# EAGLE design BUF_BUS_TEE_1 (EAGLE 6.5.0)

## Sheet 1 of 4
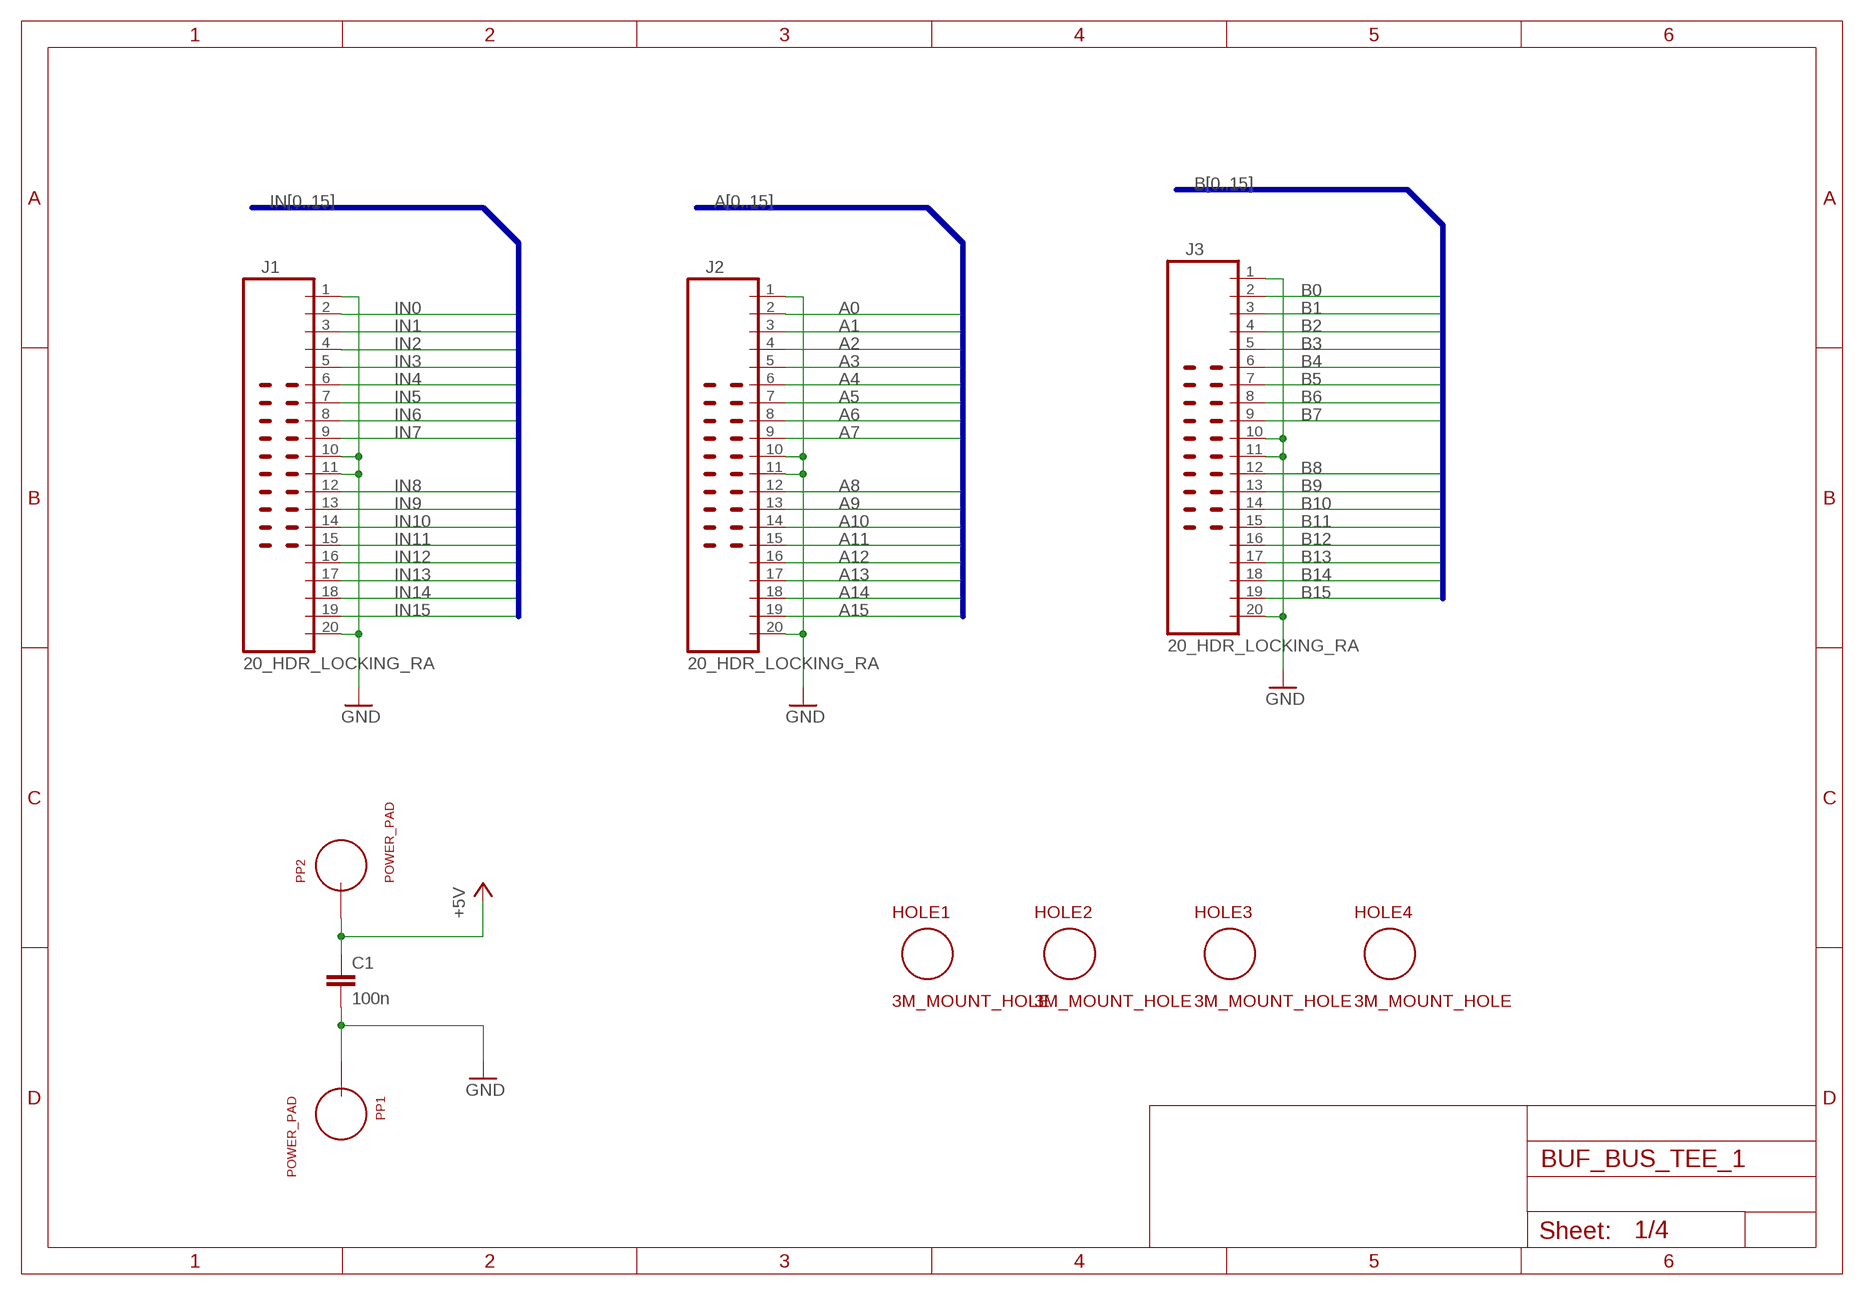
[diagram p0: schematic, sheet 1]

### Parts
C1  100n  C_P2INCH  [CAP_P2INCH]
HOLE1  3M_MOUNT_HOLE  [3M_HOLE]
HOLE2  3M_MOUNT_HOLE  [3M_HOLE]
HOLE3  3M_MOUNT_HOLE  [3M_HOLE]
HOLE4  3M_MOUNT_HOLE  [3M_HOLE]
J1  20_HDR_LOCKING_RA  [20_HDR_LOCKING_RA]
J2  20_HDR_LOCKING_RA  [20_HDR_LOCKING_RA]
J3  20_HDR_LOCKING_RA  [20_HDR_LOCKING_RA]
PP1  POWER_PAD  [POWER_PAD]
PP2  POWER_PAD  [POWER_PAD]

### Nets
+5V: C1.1 PP2.1 ; also sheet 2,3,4
A0: J2.2 ; also sheet 3
A1: J2.3 ; also sheet 3
A2: J2.4 ; also sheet 3
A3: J2.5 ; also sheet 3
A4: J2.6 ; also sheet 3
A5: J2.7 ; also sheet 3
A6: J2.8 ; also sheet 3
A7: J2.9 ; also sheet 3
A8: J2.12 ; also sheet 3
A9: J2.13 ; also sheet 3
A10: J2.14 ; also sheet 3
A11: J2.15 ; also sheet 3
A12: J2.16 ; also sheet 3
A13: J2.17 ; also sheet 3
A14: J2.18 ; also sheet 3
A15: J2.19 ; also sheet 3
B0: J3.2 ; also sheet 4
B1: J3.3 ; also sheet 4
B2: J3.4 ; also sheet 4
B3: J3.5 ; also sheet 4
B4: J3.6 ; also sheet 4
B5: J3.7 ; also sheet 4
B6: J3.8 ; also sheet 4
B7: J3.9 ; also sheet 4
B8: J3.12 ; also sheet 4
B9: J3.13 ; also sheet 4
B10: J3.14 ; also sheet 4
B11: J3.15 ; also sheet 4
B12: J3.16 ; also sheet 4
B13: J3.17 ; also sheet 4
B14: J3.18 ; also sheet 4
B15: J3.19 ; also sheet 4
GND: C1.2 J1.1 J1.10 J1.11 J1.20 J2.1 J2.10 J2.11 J2.20 J3.1 J3.10 J3.11 J3.20 PP1.1 ; also sheet 2,3,4
IN0: J1.2 ; also sheet 2
IN1: J1.3 ; also sheet 2
IN2: J1.4 ; also sheet 2
IN3: J1.5 ; also sheet 2
IN4: J1.6 ; also sheet 2
IN5: J1.7 ; also sheet 2
IN6: J1.8 ; also sheet 2
IN7: J1.9 ; also sheet 2
IN8: J1.12 ; also sheet 2
IN9: J1.13 ; also sheet 2
IN10: J1.14 ; also sheet 2
IN11: J1.15 ; also sheet 2
IN12: J1.16 ; also sheet 2
IN13: J1.17 ; also sheet 2
IN14: J1.18 ; also sheet 2
IN15: J1.19 ; also sheet 2

### Buses
IN[0..15]
A[0..15]
B[0..15]

## Sheet 2 of 4
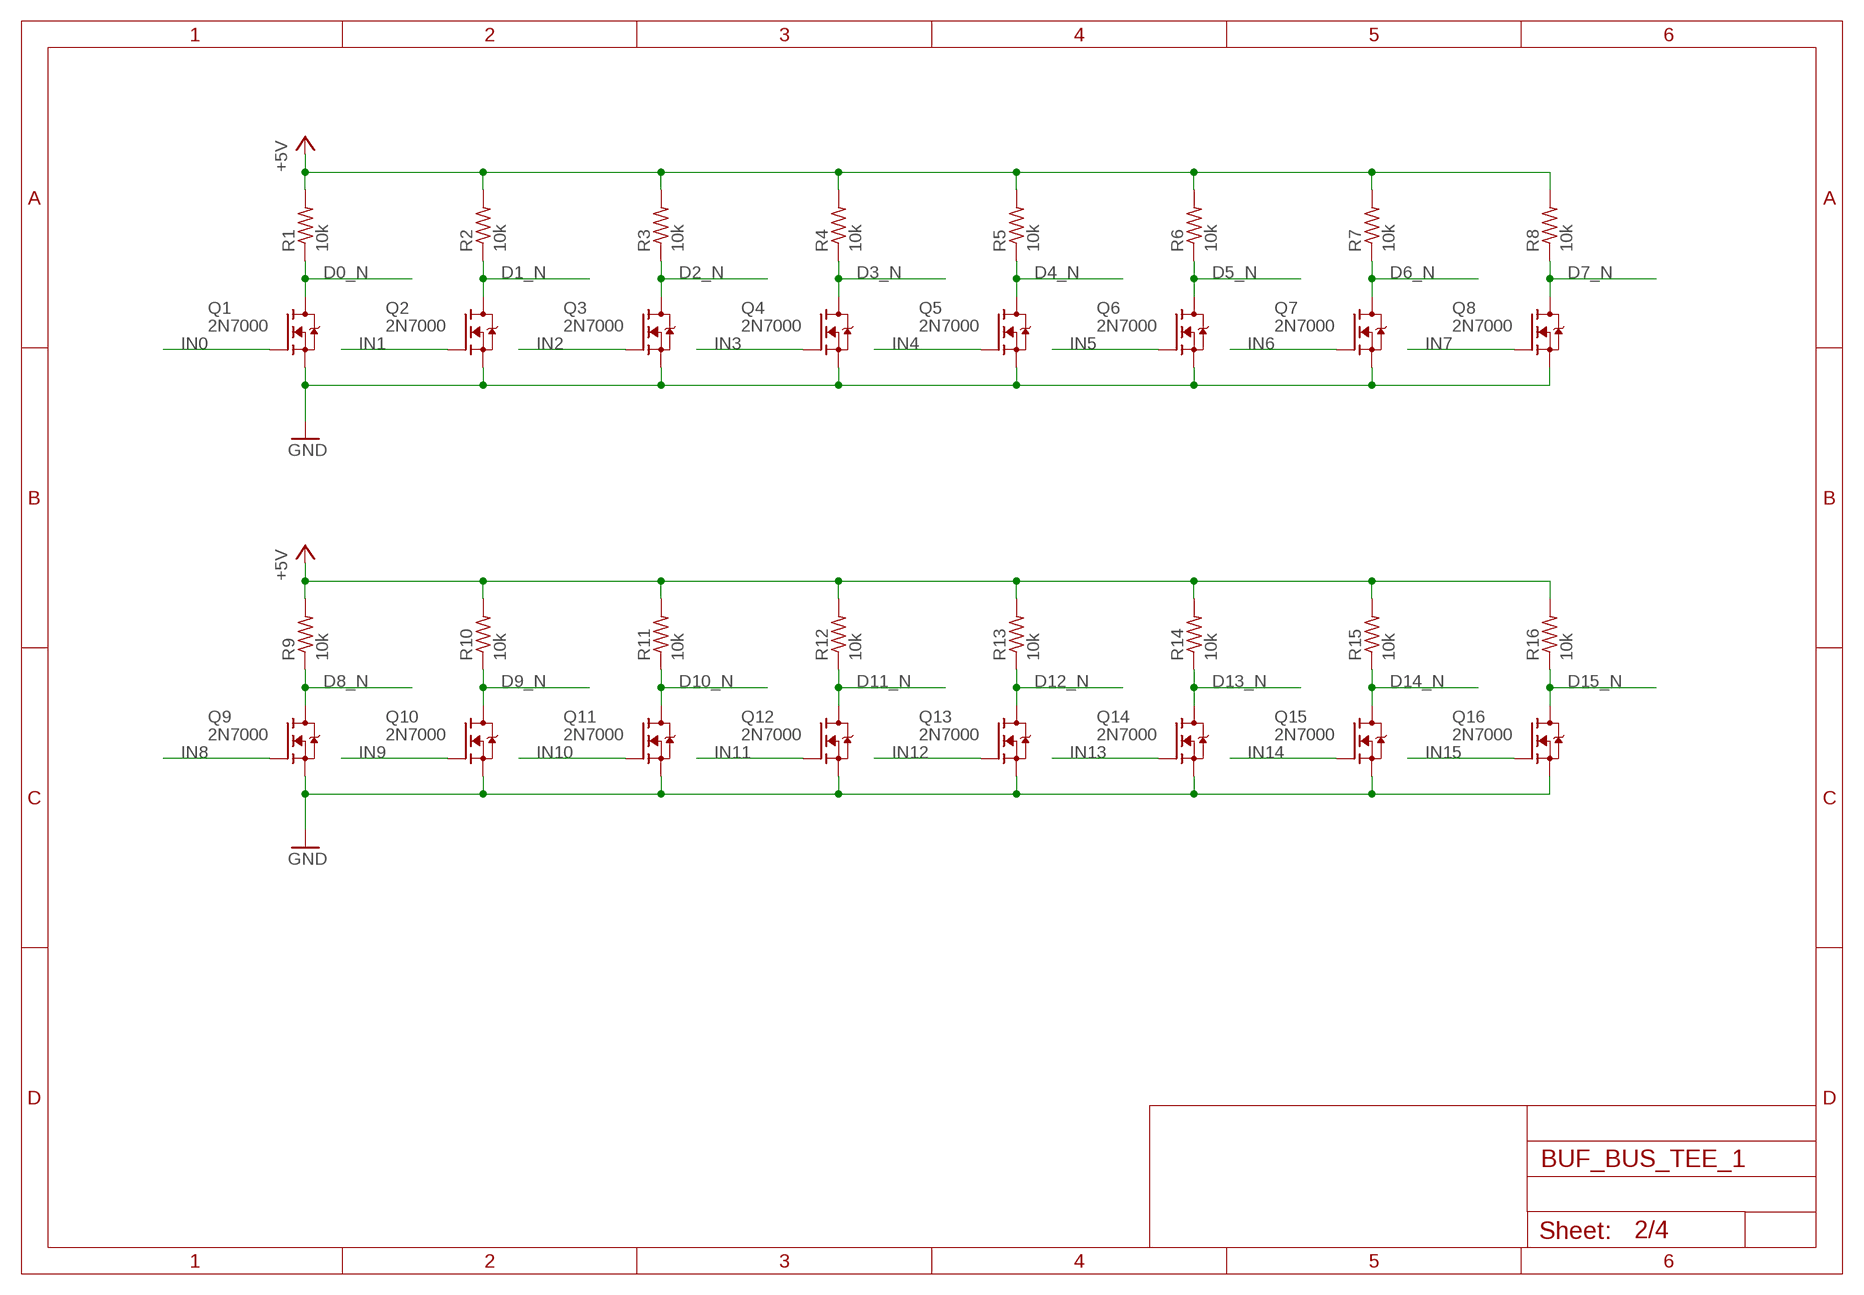
[diagram p1: schematic, sheet 2]

### Parts
Q1  2N7000  [TO92-DGS]
Q2  2N7000  [TO92-DGS]
Q3  2N7000  [TO92-DGS]
Q4  2N7000  [TO92-DGS]
Q5  2N7000  [TO92-DGS]
Q6  2N7000  [TO92-DGS]
Q7  2N7000  [TO92-DGS]
Q8  2N7000  [TO92-DGS]
Q9  2N7000  [TO92-DGS]
Q10  2N7000  [TO92-DGS]
Q11  2N7000  [TO92-DGS]
Q12  2N7000  [TO92-DGS]
Q13  2N7000  [TO92-DGS]
Q14  2N7000  [TO92-DGS]
Q15  2N7000  [TO92-DGS]
Q16  2N7000  [TO92-DGS]
R1  10k  R_P2INCH  [R_P2INCH]
R2  10k  R_P2INCH  [R_P2INCH]
R3  10k  R_P2INCH  [R_P2INCH]
R4  10k  R_P2INCH  [R_P2INCH]
R5  10k  R_P2INCH  [R_P2INCH]
R6  10k  R_P2INCH  [R_P2INCH]
R7  10k  R_P2INCH  [R_P2INCH]
R8  10k  R_P2INCH  [R_P2INCH]
R9  10k  R_P2INCH  [R_P2INCH]
R10  10k  R_P2INCH  [R_P2INCH]
R11  10k  R_P2INCH  [R_P2INCH]
R12  10k  R_P2INCH  [R_P2INCH]
R13  10k  R_P2INCH  [R_P2INCH]
R14  10k  R_P2INCH  [R_P2INCH]
R15  10k  R_P2INCH  [R_P2INCH]
R16  10k  R_P2INCH  [R_P2INCH]

### Nets
+5V: R1.2 R2.2 R3.2 R4.2 R5.2 R6.2 R7.2 R8.2 R9.2 R10.2 R11.2 R12.2 R13.2 R14.2 R15.2 R16.2 ; also sheet 1,3,4
D0_N: Q1.D R1.1 ; also sheet 3,4
D1_N: Q2.D R2.1 ; also sheet 3,4
D2_N: Q3.D R3.1 ; also sheet 3,4
D3_N: Q4.D R4.1 ; also sheet 3,4
D4_N: Q5.D R5.1 ; also sheet 3,4
D5_N: Q6.D R6.1 ; also sheet 3,4
D6_N: Q7.D R7.1 ; also sheet 3,4
D7_N: Q8.D R8.1 ; also sheet 3,4
D8_N: Q9.D R9.1 ; also sheet 3,4
D9_N: Q10.D R10.1 ; also sheet 3,4
D10_N: Q11.D R11.1 ; also sheet 3,4
D11_N: Q12.D R12.1 ; also sheet 3,4
D12_N: Q13.D R13.1 ; also sheet 3,4
D13_N: Q14.D R14.1 ; also sheet 3,4
D14_N: Q15.D R15.1 ; also sheet 3,4
D15_N: Q16.D R16.1 ; also sheet 3,4
GND: Q1.S Q2.S Q3.S Q4.S Q5.S Q6.S Q7.S Q8.S Q9.S Q10.S Q11.S Q12.S Q13.S Q14.S Q15.S Q16.S ; also sheet 1,3,4
IN0: Q1.G ; also sheet 1
IN1: Q2.G ; also sheet 1
IN2: Q3.G ; also sheet 1
IN3: Q4.G ; also sheet 1
IN4: Q5.G ; also sheet 1
IN5: Q6.G ; also sheet 1
IN6: Q7.G ; also sheet 1
IN7: Q8.G ; also sheet 1
IN8: Q9.G ; also sheet 1
IN9: Q10.G ; also sheet 1
IN10: Q11.G ; also sheet 1
IN11: Q12.G ; also sheet 1
IN12: Q13.G ; also sheet 1
IN13: Q14.G ; also sheet 1
IN14: Q15.G ; also sheet 1
IN15: Q16.G ; also sheet 1

## Sheet 3 of 4
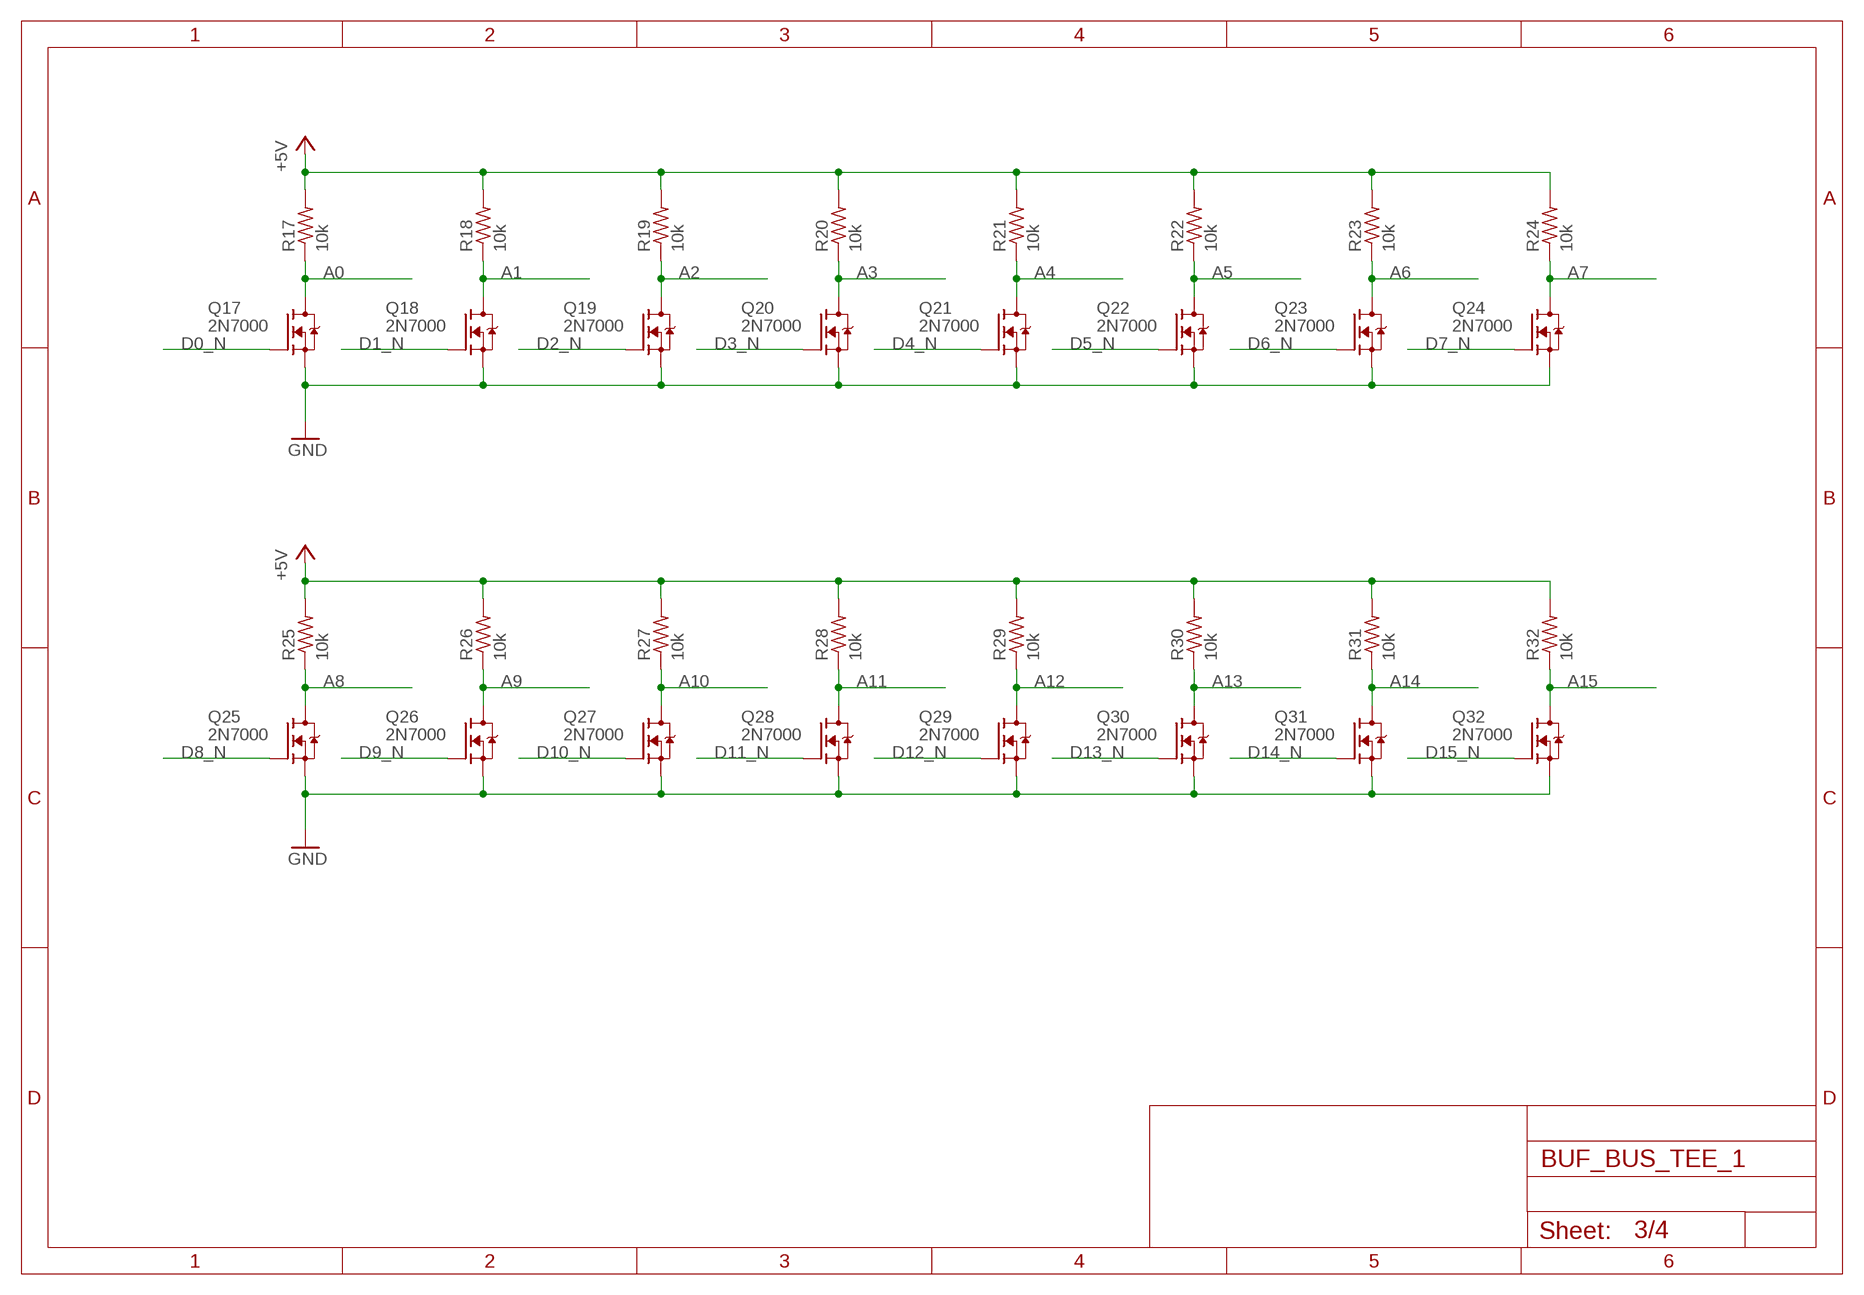
[diagram p2: schematic, sheet 3]

### Parts
Q17  2N7000  [TO92-DGS]
Q18  2N7000  [TO92-DGS]
Q19  2N7000  [TO92-DGS]
Q20  2N7000  [TO92-DGS]
Q21  2N7000  [TO92-DGS]
Q22  2N7000  [TO92-DGS]
Q23  2N7000  [TO92-DGS]
Q24  2N7000  [TO92-DGS]
Q25  2N7000  [TO92-DGS]
Q26  2N7000  [TO92-DGS]
Q27  2N7000  [TO92-DGS]
Q28  2N7000  [TO92-DGS]
Q29  2N7000  [TO92-DGS]
Q30  2N7000  [TO92-DGS]
Q31  2N7000  [TO92-DGS]
Q32  2N7000  [TO92-DGS]
R17  10k  R_P2INCH  [R_P2INCH]
R18  10k  R_P2INCH  [R_P2INCH]
R19  10k  R_P2INCH  [R_P2INCH]
R20  10k  R_P2INCH  [R_P2INCH]
R21  10k  R_P2INCH  [R_P2INCH]
R22  10k  R_P2INCH  [R_P2INCH]
R23  10k  R_P2INCH  [R_P2INCH]
R24  10k  R_P2INCH  [R_P2INCH]
R25  10k  R_P2INCH  [R_P2INCH]
R26  10k  R_P2INCH  [R_P2INCH]
R27  10k  R_P2INCH  [R_P2INCH]
R28  10k  R_P2INCH  [R_P2INCH]
R29  10k  R_P2INCH  [R_P2INCH]
R30  10k  R_P2INCH  [R_P2INCH]
R31  10k  R_P2INCH  [R_P2INCH]
R32  10k  R_P2INCH  [R_P2INCH]

### Nets
+5V: R17.2 R18.2 R19.2 R20.2 R21.2 R22.2 R23.2 R24.2 R25.2 R26.2 R27.2 R28.2 R29.2 R30.2 R31.2 R32.2 ; also sheet 1,2,4
A0: Q17.D R17.1 ; also sheet 1
A1: Q18.D R18.1 ; also sheet 1
A2: Q19.D R19.1 ; also sheet 1
A3: Q20.D R20.1 ; also sheet 1
A4: Q21.D R21.1 ; also sheet 1
A5: Q22.D R22.1 ; also sheet 1
A6: Q23.D R23.1 ; also sheet 1
A7: Q24.D R24.1 ; also sheet 1
A8: Q25.D R25.1 ; also sheet 1
A9: Q26.D R26.1 ; also sheet 1
A10: Q27.D R27.1 ; also sheet 1
A11: Q28.D R28.1 ; also sheet 1
A12: Q29.D R29.1 ; also sheet 1
A13: Q30.D R30.1 ; also sheet 1
A14: Q31.D R31.1 ; also sheet 1
A15: Q32.D R32.1 ; also sheet 1
D0_N: Q17.G ; also sheet 2,4
D1_N: Q18.G ; also sheet 2,4
D2_N: Q19.G ; also sheet 2,4
D3_N: Q20.G ; also sheet 2,4
D4_N: Q21.G ; also sheet 2,4
D5_N: Q22.G ; also sheet 2,4
D6_N: Q23.G ; also sheet 2,4
D7_N: Q24.G ; also sheet 2,4
D8_N: Q25.G ; also sheet 2,4
D9_N: Q26.G ; also sheet 2,4
D10_N: Q27.G ; also sheet 2,4
D11_N: Q28.G ; also sheet 2,4
D12_N: Q29.G ; also sheet 2,4
D13_N: Q30.G ; also sheet 2,4
D14_N: Q31.G ; also sheet 2,4
D15_N: Q32.G ; also sheet 2,4
GND: Q17.S Q18.S Q19.S Q20.S Q21.S Q22.S Q23.S Q24.S Q25.S Q26.S Q27.S Q28.S Q29.S Q30.S Q31.S Q32.S ; also sheet 1,2,4

## Sheet 4 of 4
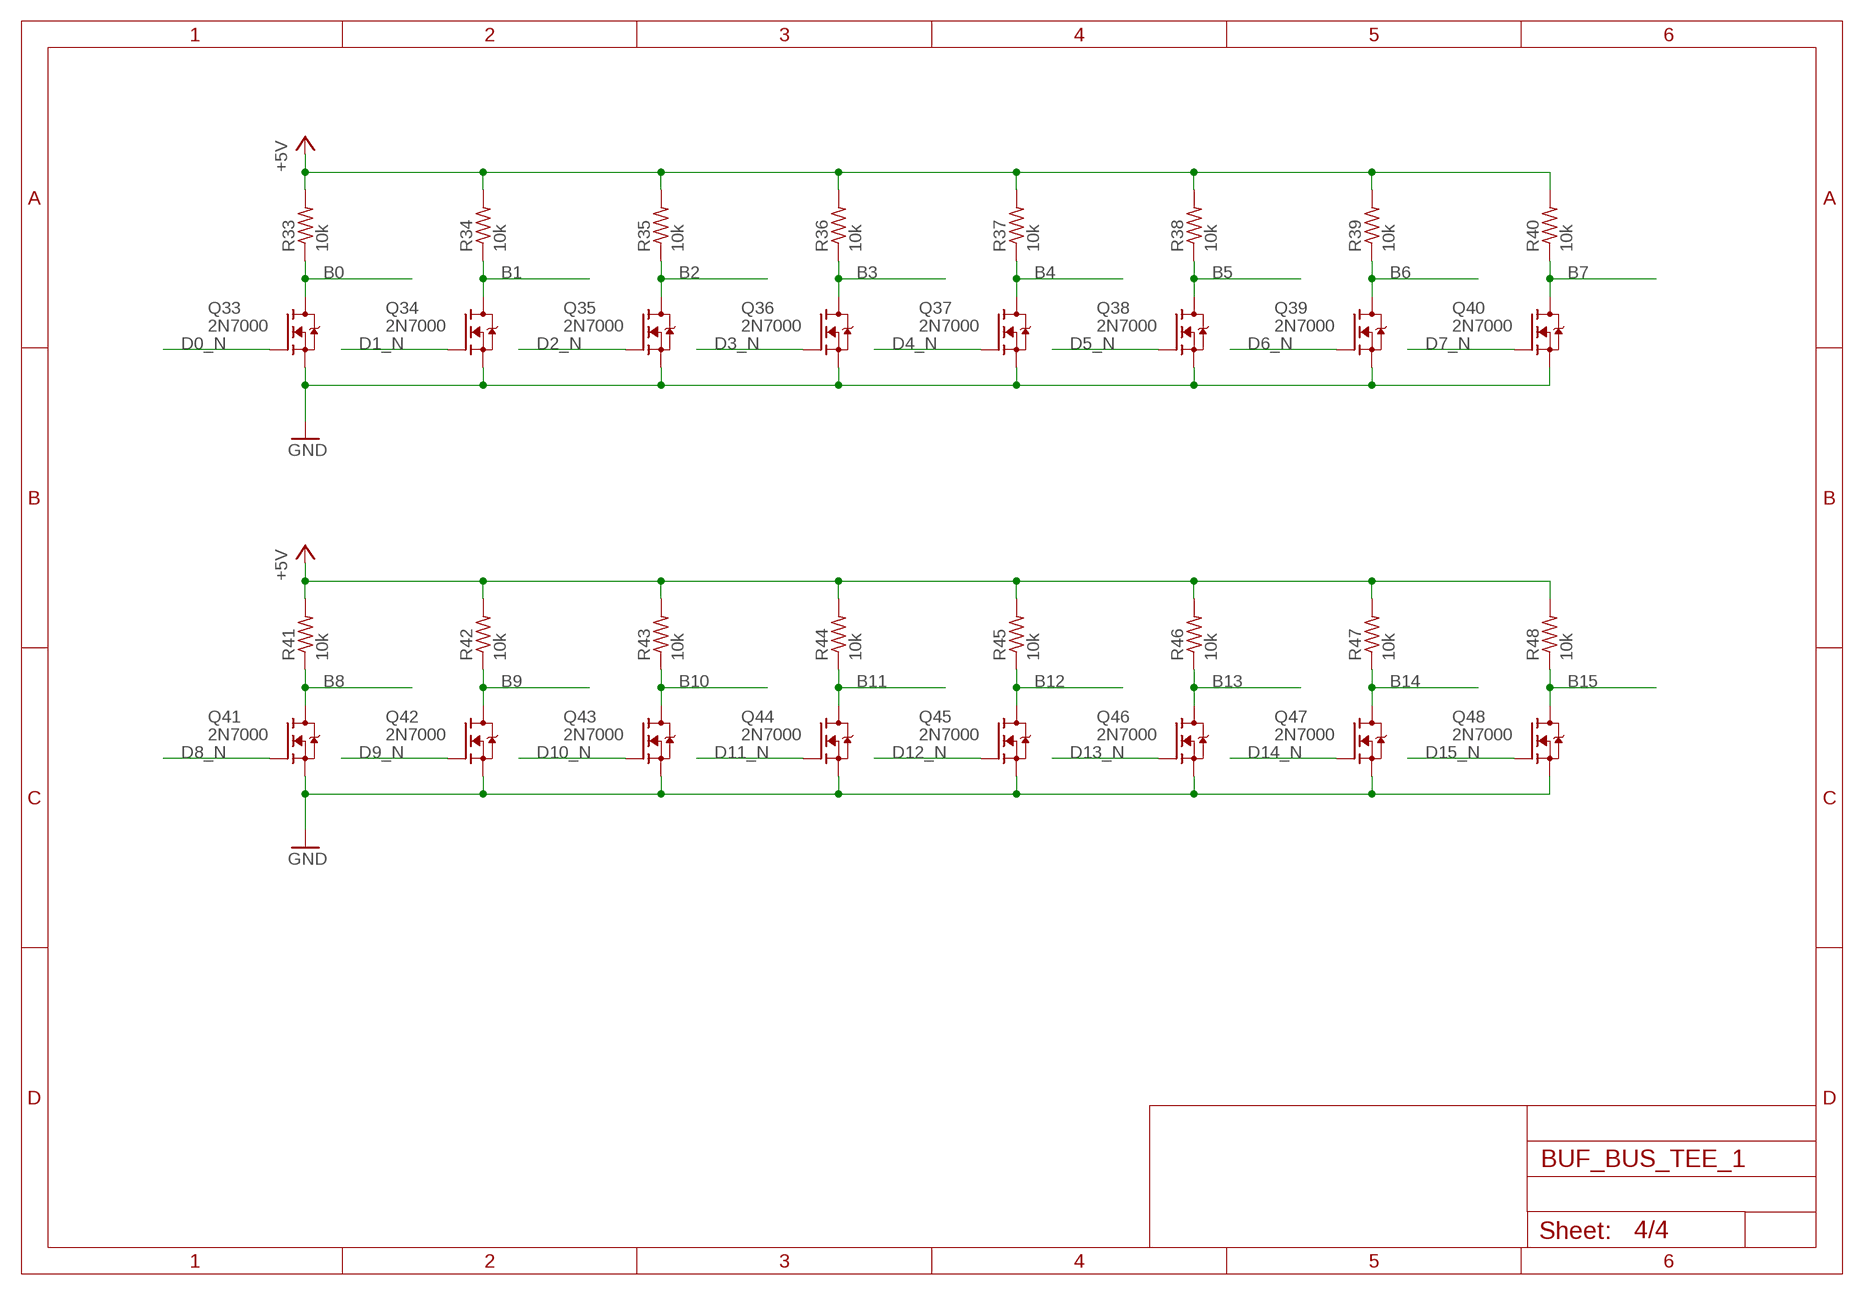
[diagram p3: schematic, sheet 4]

### Parts
Q33  2N7000  [TO92-DGS]
Q34  2N7000  [TO92-DGS]
Q35  2N7000  [TO92-DGS]
Q36  2N7000  [TO92-DGS]
Q37  2N7000  [TO92-DGS]
Q38  2N7000  [TO92-DGS]
Q39  2N7000  [TO92-DGS]
Q40  2N7000  [TO92-DGS]
Q41  2N7000  [TO92-DGS]
Q42  2N7000  [TO92-DGS]
Q43  2N7000  [TO92-DGS]
Q44  2N7000  [TO92-DGS]
Q45  2N7000  [TO92-DGS]
Q46  2N7000  [TO92-DGS]
Q47  2N7000  [TO92-DGS]
Q48  2N7000  [TO92-DGS]
R33  10k  R_P2INCH  [R_P2INCH]
R34  10k  R_P2INCH  [R_P2INCH]
R35  10k  R_P2INCH  [R_P2INCH]
R36  10k  R_P2INCH  [R_P2INCH]
R37  10k  R_P2INCH  [R_P2INCH]
R38  10k  R_P2INCH  [R_P2INCH]
R39  10k  R_P2INCH  [R_P2INCH]
R40  10k  R_P2INCH  [R_P2INCH]
R41  10k  R_P2INCH  [R_P2INCH]
R42  10k  R_P2INCH  [R_P2INCH]
R43  10k  R_P2INCH  [R_P2INCH]
R44  10k  R_P2INCH  [R_P2INCH]
R45  10k  R_P2INCH  [R_P2INCH]
R46  10k  R_P2INCH  [R_P2INCH]
R47  10k  R_P2INCH  [R_P2INCH]
R48  10k  R_P2INCH  [R_P2INCH]

### Nets
+5V: R33.2 R34.2 R35.2 R36.2 R37.2 R38.2 R39.2 R40.2 R41.2 R42.2 R43.2 R44.2 R45.2 R46.2 R47.2 R48.2 ; also sheet 1,2,3
B0: Q33.D R33.1 ; also sheet 1
B1: Q34.D R34.1 ; also sheet 1
B2: Q35.D R35.1 ; also sheet 1
B3: Q36.D R36.1 ; also sheet 1
B4: Q37.D R37.1 ; also sheet 1
B5: Q38.D R38.1 ; also sheet 1
B6: Q39.D R39.1 ; also sheet 1
B7: Q40.D R40.1 ; also sheet 1
B8: Q41.D R41.1 ; also sheet 1
B9: Q42.D R42.1 ; also sheet 1
B10: Q43.D R43.1 ; also sheet 1
B11: Q44.D R44.1 ; also sheet 1
B12: Q45.D R45.1 ; also sheet 1
B13: Q46.D R46.1 ; also sheet 1
B14: Q47.D R47.1 ; also sheet 1
B15: Q48.D R48.1 ; also sheet 1
D0_N: Q33.G ; also sheet 2,3
D1_N: Q34.G ; also sheet 2,3
D2_N: Q35.G ; also sheet 2,3
D3_N: Q36.G ; also sheet 2,3
D4_N: Q37.G ; also sheet 2,3
D5_N: Q38.G ; also sheet 2,3
D6_N: Q39.G ; also sheet 2,3
D7_N: Q40.G ; also sheet 2,3
D8_N: Q41.G ; also sheet 2,3
D9_N: Q42.G ; also sheet 2,3
D10_N: Q43.G ; also sheet 2,3
D11_N: Q44.G ; also sheet 2,3
D12_N: Q45.G ; also sheet 2,3
D13_N: Q46.G ; also sheet 2,3
D14_N: Q47.G ; also sheet 2,3
D15_N: Q48.G ; also sheet 2,3
GND: Q33.S Q34.S Q35.S Q36.S Q37.S Q38.S Q39.S Q40.S Q41.S Q42.S Q43.S Q44.S Q45.S Q46.S Q47.S Q48.S ; also sheet 1,2,3

## Library data of the parts
C1 = MyLib:C_P2INCH
HOLE1-HOLE4 = MyLib:3M_MOUNT_HOLE
J1-J3 = MyLib:20_HDR_LOCKING_RA
PP1 PP2 = MyLib:POWER_PAD
Q1-Q48 = MyLib:2N7000
R1-R48 = MyLib:R_P2INCH

## Board
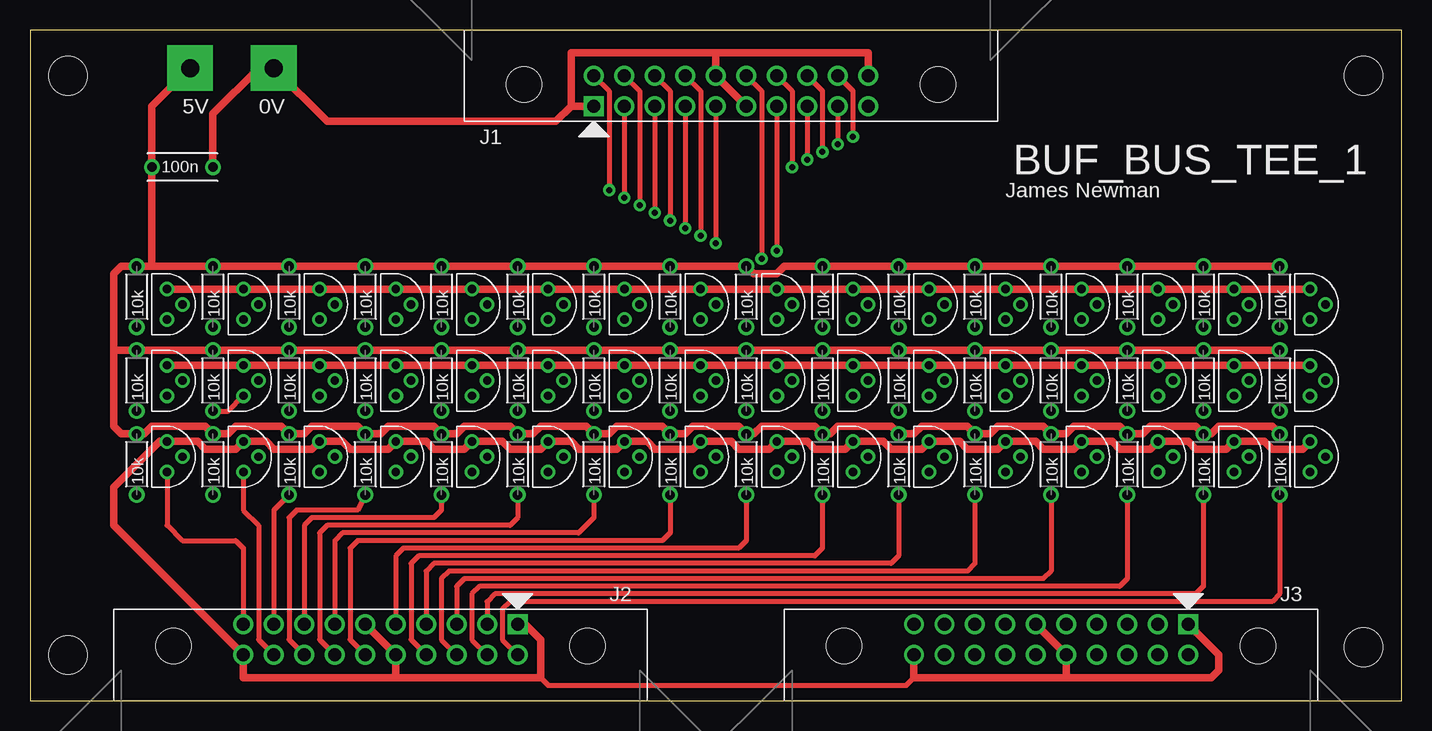
[diagram p4: board, top side]
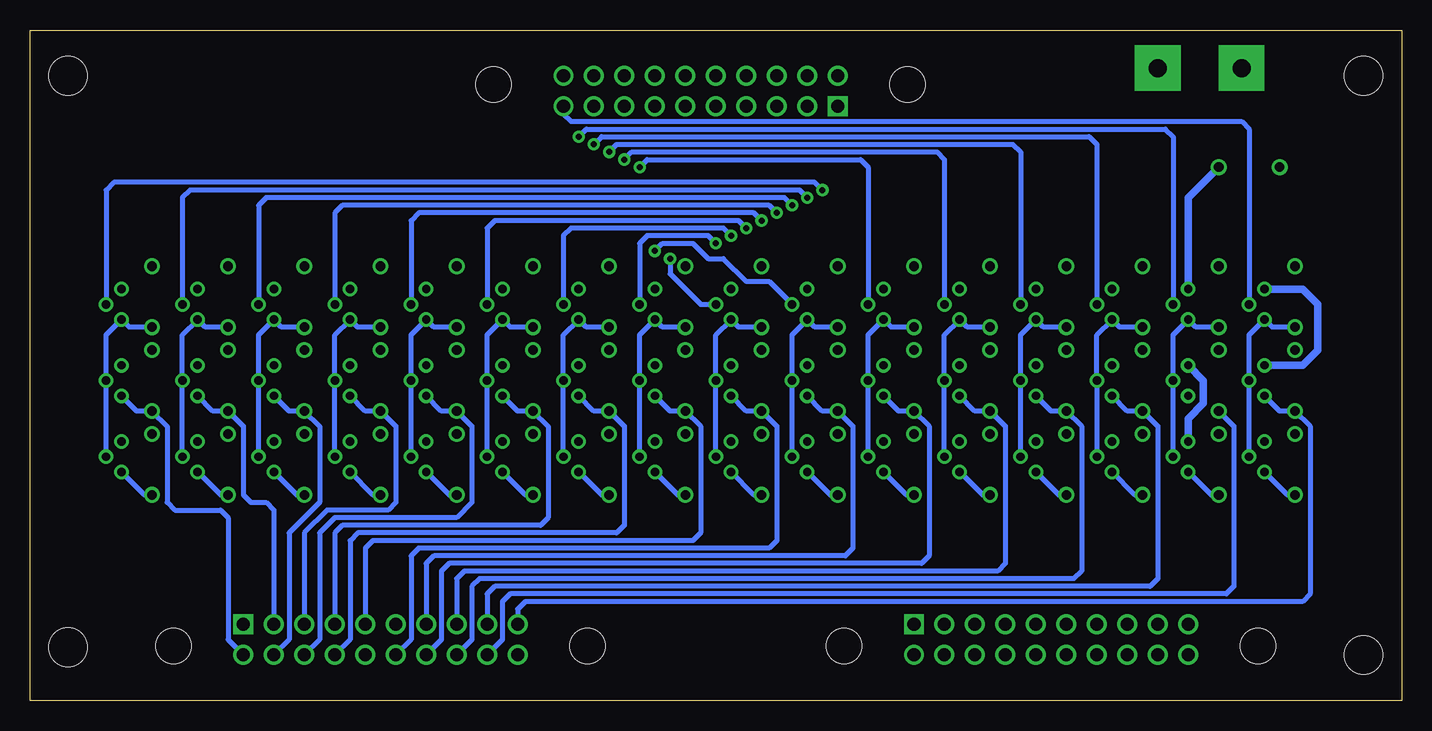
[diagram p5: board, bottom side, seen from below]

Size 114.3 x 55.88 mm. Coordinates in mm from the lower left corner, seen from the top.
Outline: 0,0 114.3,0 114.3,55.88 0,55.88 0,0
Copper layers (1*16): Top 0.035mm / dielectric 1.5mm / Bottom 0.035mm
Design rules "processor_rules_2layer": minimum track width 8mil, minimum drill 14mil, track to track 8mil, track to pad 8mil, pad to pad 8mil, via to via 8mil, smd to smd 8mil, copper to edge 40mil, drill to drill 8mil, minimum pad ring 10mil, minimum via ring 8mil, stop-mask expansion 4mil, vias tented up to drill 0.7mm, thermal gap 10mil

### Footprints (pad centres in the part's own frame; a part is rotated, then mirrored left to right if it is on the bottom)
CAP_P2INCH = drill 0.8: 1 -2.54,0; 2 2.54,0
3M_HOLE = hole 3.2: 0,0
20_HDR_LOCKING_RA = drill 1.1 square: 1 -11.43,-1.27 | drill 1.1: 2 -11.43,1.27; 3 -8.89,-1.27; 4 -8.89,1.27; 5 -6.35,-1.27; 6 -6.35,1.27; 7 -3.81,-1.27; 8 -3.81,1.27; 9 -1.27,-1.27; 10 -1.27,1.27; 11 1.27,-1.27; 12 1.27,1.27; 13 3.81,-1.27; 14 3.81,1.27; 15 6.35,-1.27; 16 6.35,1.27; 17 8.89,-1.27; 18 8.89,1.27; 19 11.43,-1.27; 20 11.43,1.27 | hole 2.946: -17.247,0.533; 17.247,0.533
POWER_PAD = drill 1.5 pad 3.81 square: 1 0,0
TO92-DGS = drill 0.7: D 0,1.27; G -1.27,0; S 0,-1.27
R_P2INCH = drill 0.8: 1 -2.54,0; 2 2.54,0

### Placement (x,y rotation side)
C1  12.7,44.45 0 top
HOLE1  3.17,3.81 0 top
HOLE2  111.12,4.45 0 top
HOLE3  111.12,52.07 0 top
HOLE4  3.17,52.07 0 top
J1  58.42,50.8 0 top
J2  29.21,5.08 180 top
J3  85.09,5.08 180 top
PP1  20.32,52.7 0 top
PP2  13.34,52.7 0 top
Q1  106.68,33.02 180 top
Q2  100.33,33.02 180 top
Q3  93.98,33.02 180 top
Q4  87.63,33.02 180 top
Q5  81.28,33.02 180 top
Q6  74.93,33.02 180 top
Q7  68.58,33.02 180 top
Q8  62.23,33.02 180 top
Q9  55.88,33.02 180 top
Q10  49.53,33.02 180 top
Q11  43.18,33.02 180 top
Q12  36.83,33.02 180 top
Q13  30.48,33.02 180 top
Q14  24.13,33.02 180 top
Q15  17.78,33.02 180 top
Q16  11.43,33.02 180 top
Q17  106.68,20.32 180 top
Q18  100.33,20.32 180 top
Q19  93.98,20.32 180 top
Q20  87.63,20.32 180 top
Q21  81.28,20.32 180 top
Q22  74.93,20.32 180 top
Q23  68.58,20.32 180 top
Q24  62.23,20.32 180 top
Q25  55.88,20.32 180 top
Q26  49.53,20.32 180 top
Q27  43.18,20.32 180 top
Q28  36.83,20.32 180 top
Q29  30.48,20.32 180 top
Q30  24.13,20.32 180 top
Q31  17.78,20.32 180 top
Q32  11.43,20.32 180 top
Q33  106.68,26.67 180 top
Q34  100.33,26.67 180 top
Q35  93.98,26.67 180 top
Q36  87.63,26.67 180 top
Q37  81.28,26.67 180 top
Q38  74.93,26.67 180 top
Q39  68.58,26.67 180 top
Q40  62.23,26.67 180 top
Q41  55.88,26.67 180 top
Q42  49.53,26.67 180 top
Q43  43.18,26.67 180 top
Q44  36.83,26.67 180 top
Q45  30.48,26.67 180 top
Q46  24.13,26.67 180 top
Q47  17.78,26.67 180 top
Q48  11.43,26.67 180 top
R1  104.14,33.66 90 top
R2  97.79,33.66 90 top
R3  91.44,33.66 90 top
R4  85.09,33.66 90 top
R5  78.74,33.66 90 top
R6  72.39,33.66 90 top
R7  66.04,33.66 90 top
R8  59.69,33.66 90 top
R9  53.34,33.66 90 top
R10  46.99,33.66 90 top
R11  40.64,33.66 90 top
R12  34.29,33.66 90 top
R13  27.94,33.66 90 top
R14  21.59,33.66 90 top
R15  15.24,33.66 90 top
R16  8.89,33.66 90 top
R17  104.14,19.68 90 top
R18  97.79,19.68 90 top
R19  91.44,19.68 90 top
R20  85.09,19.68 90 top
R21  78.74,19.68 90 top
R22  72.39,19.68 90 top
R23  66.04,19.68 90 top
R24  59.69,19.68 90 top
R25  53.34,19.68 90 top
R26  46.99,19.68 90 top
R27  40.64,19.68 90 top
R28  34.29,19.68 90 top
R29  27.94,19.68 90 top
R30  21.59,19.68 90 top
R31  15.24,19.68 90 top
R32  8.89,19.68 90 top
R33  104.14,26.67 90 top
R34  97.79,26.67 90 top
R35  91.44,26.67 90 top
R36  85.09,26.67 90 top
R37  78.74,26.67 90 top
R38  72.39,26.67 90 top
R39  66.04,26.67 90 top
R40  59.69,26.67 90 top
R41  53.34,26.67 90 top
R42  46.99,26.67 90 top
R43  40.64,26.67 90 top
R44  34.29,26.67 90 top
R45  27.94,26.67 90 top
R46  21.59,26.67 90 top
R47  15.24,26.67 90 top
R48  8.89,26.67 90 top

### Tracks (layer width: path | path; a pad name or v marks a point on that pad's centre or on a via)
+5V
  Top 0.61: 10.16,36.2 R16.2 7.62,36.2 6.99,35.56 6.99,29.21 | 10.16,36.2 R15.2 R14.2 R13.2 R12.2 R11.2 R10.2 R9.2 R8.2 60.33,35.56 62.23,35.56 62.87,36.2 R7.2 R6.2 R5.2 R4.2 R3.2 R2.2 R1.2 | R33.2 R34.2 R35.2 R36.2 R37.2 R38.2 R39.2 R40.2 R41.2 R42.2 R43.2 R44.2 R45.2 R46.2 R47.2 R48.2 6.99,29.21 | R17.2 103.5,22.86 99.06,22.86 98.42,22.23 R18.2 97.16,22.86 93.34,22.86 92.71,22.23 R19.2 90.81,22.86 87,22.86 86.36,22.23 R20.2 84.45,22.86 80.64,22.86 80.01,22.23 R21.2 78.11,22.86 74.3,22.86 73.66,22.23 R22.2 71.75,22.86 67.31,22.86 66.67,22.23 R23.2 65.41,22.86 60.96,22.86 60.33,22.23 R24.2 59.05,22.86 55.24,22.86 54.61,22.23 R25.2 52.7,22.86 48.9,22.86 48.26,22.23 R26.2 46.35,22.86 42.55,22.86 41.91,22.23 R27.2 40.01,22.86 36.2,22.86 35.56,22.23 R28.2 33.66,22.86 29.84,22.86 29.21,22.23 R29.2 27.3,22.86 23.5,22.86 22.86,22.23 R30.2 20.95,22.86 17.14,22.86 16.51,22.23 R31.2 14.61,22.86 10.16,22.86 9.53,22.23 R32.2 7.62,22.23 6.99,22.86 6.99,29.21 | 10.16,36.2 C1.1 10.16,49.53 PP2.1
A0
  Top 0.406: R17.1 104.14,8.89 103.5,8.26 40.01,8.26 39.37,7.62 39.37,5.08 J2.2
  Bottom 0.406: R17.1 104.78,17.14 Q17.D
A1
  Top 0.406: R18.1 97.79,9.53 97.16,8.89 38.73,8.89 38.1,8.26 J2.3
  Bottom 0.406: R18.1 98.42,17.14 Q18.D
A2
  Top 0.406: R19.1 91.44,10.16 90.81,9.53 37.47,9.53 36.83,8.89 36.83,5.08 J2.4
  Bottom 0.406: R19.1 92.08,17.14 Q19.D
A3
  Top 0.406: R20.1 85.09,10.79 84.45,10.16 36.2,10.16 35.56,9.53 J2.5
  Bottom 0.406: R20.1 85.72,17.14 Q20.D
A4
  Top 0.406: R21.1 78.74,11.43 78.11,10.79 34.92,10.79 34.29,10.16 34.29,5.08 J2.6
  Bottom 0.406: R21.1 79.38,17.14 Q21.D
A5
  Top 0.406: R22.1 72.39,12.06 71.75,11.43 33.66,11.43 33.02,10.79 J2.7
  Bottom 0.406: R22.1 73.03,17.14 Q22.D
A6
  Top 0.406: R23.1 66.04,12.7 65.41,12.06 32.38,12.06 31.75,11.43 31.75,5.08 J2.8
  Bottom 0.406: R23.1 66.67,17.14 Q23.D
A7
  Top 0.406: R24.1 59.69,13.34 59.05,12.7 31.11,12.7 30.48,12.06 J2.9
  Bottom 0.406: R24.1 60.33,17.14 Q24.D
A8
  Top 0.406: R25.1 53.34,13.97 52.7,13.34 27.3,13.34 26.67,12.7 26.67,5.08 J2.12
  Bottom 0.406: R25.1 53.98,17.14 Q25.D
A9
  Top 0.406: R26.1 46.99,15.24 45.72,13.97 26.04,13.97 25.4,13.34 J2.13
  Bottom 0.406: R26.1 47.62,17.14 Q26.D
A10
  Top 0.406: R27.1 40.64,15.24 40.01,14.61 24.77,14.61 24.13,13.97 24.13,5.08 J2.14
  Bottom 0.406: R27.1 41.27,17.14 Q27.D
A11
  Top 0.406: R28.1 34.29,15.88 33.66,15.24 23.5,15.24 22.86,14.61 J2.15
  Bottom 0.406: R28.1 34.92,17.14 Q28.D
A12
  Top 0.406: R29.1 27.3,15.88 22.23,15.88 21.59,15.24 21.59,5.08 J2.16
  Bottom 0.406: R29.1 28.57,17.14 Q29.D
A13
  Top 0.406: R30.1 20.32,15.88 J2.17
  Bottom 0.406: R30.1 22.23,17.14 Q30.D
A14
  Top 0.406: Q31.D 17.78,15.88 19.05,14.61 19.05,5.08 J2.18
  Bottom 0.406: R31.1 15.88,17.14 Q31.D
A15
  Top 0.406: Q32.D 11.43,14.61 12.7,13.34 17.14,13.34 17.78,12.7 J2.19
  Bottom 0.406: R32.1 9.53,17.14 Q32.D
B0
  Bottom 0.406: J3.2 97.79,5.08 97.79,15.24 98.42,15.88 102.23,15.88 102.87,16.51 102.87,22.86 R33.1 105.41,24.13 Q33.D
B1
  Bottom 0.406: J3.3 93.98,15.88 94.61,16.51 95.89,16.51 96.52,17.14 96.52,22.86 R34.1 99.06,24.13 Q34.D
B2
  Bottom 0.406: J3.4 92.71,5.08 92.71,13.97 90.17,16.51 90.17,22.86 R35.1 92.71,24.13 Q35.D
B3
  Bottom 0.406: J3.5 91.44,13.97 89.53,15.88 84.45,15.88 83.82,16.51 83.82,22.86 R36.1 86.36,24.13 Q36.D
B4
  Bottom 0.406: J3.6 90.17,5.08 90.17,13.97 88.9,15.24 78.74,15.24 77.47,16.51 77.47,22.86 R37.1 80.01,24.13 Q37.D
B5
  Bottom 0.406: J3.7 88.9,13.97 88.27,14.61 71.75,14.61 71.12,15.24 71.12,22.86 R38.1 73.66,24.13 Q38.D
B6
  Bottom 0.406: J3.8 87.63,5.08 87.63,13.34 87,13.97 65.41,13.97 64.77,14.61 64.77,22.86 R39.1 67.31,24.13 Q39.D
B7
  Bottom 0.406: J3.9 86.36,12.7 85.72,13.34 59.05,13.34 58.42,13.97 58.42,22.86 R40.1 60.96,24.13 Q40.D
B8
  Bottom 0.406: J3.12 82.55,5.08 82.55,12.06 81.92,12.7 52.7,12.7 52.07,13.34 52.07,22.86 R41.1 54.61,24.13 Q41.D
B9
  Bottom 0.406: J3.13 81.28,11.43 80.64,12.06 46.35,12.06 45.72,12.7 45.72,22.86 R42.1 48.26,24.13 Q42.D
B10
  Bottom 0.406: J3.14 80.01,5.08 80.01,10.79 79.38,11.43 40.01,11.43 39.37,12.06 39.37,22.86 R43.1 41.91,24.13 Q43.D
B11
  Bottom 0.406: J3.15 78.74,10.16 78.11,10.79 33.66,10.79 33.02,11.43 33.02,22.86 R44.1 35.56,24.13 Q44.D
B12
  Bottom 0.406: J3.16 77.47,5.08 77.47,9.53 76.83,10.16 27.3,10.16 26.67,10.79 26.67,22.86 R45.1 29.21,24.13 Q45.D
B13
  Bottom 0.406: J3.17 76.2,8.89 75.56,9.53 20.95,9.53 20.32,10.16 20.32,22.86 R46.1 22.86,24.13 Q46.D
B14
  Top 0.406: R47.1 16.51,24.13 Q47.D
  Bottom 0.406: J3.18 74.93,5.08 74.93,8.26 74.3,8.89 14.61,8.89 13.97,9.53 13.97,22.86 R47.1
B15
  Bottom 0.406: J3.19 73.66,7.62 73.03,8.26 8.26,8.26 7.62,8.89 7.62,22.86 R48.1 10.16,24.13 Q48.D
D0_N
  Bottom 0.406: R1.1 106.05,31.11 Q1.D 107.95,30.48 Q33.G Q17.G
D1_N
  Bottom 0.406: R2.1 99.69,31.11 Q2.D 101.6,30.48 Q34.G Q18.G
D2_N
  Bottom 0.406: R3.1 93.34,31.11 Q3.D 95.25,30.48 Q35.G Q19.G
D3_N
  Bottom 0.406: R4.1 87,31.11 Q4.D 88.9,30.48 Q36.G Q20.G
D4_N
  Bottom 0.406: R5.1 80.64,31.11 Q5.D 82.55,30.48 Q37.G Q21.G
D5_N
  Bottom 0.406: R6.1 74.3,31.11 Q6.D 76.2,30.48 Q38.G Q22.G
D6_N
  Bottom 0.406: R7.1 67.94,31.11 Q7.D 69.85,30.48 Q39.G Q23.G
D7_N
  Bottom 0.406: R8.1 61.59,31.11 Q8.D 63.5,30.48 Q40.G Q24.G
D8_N
  Bottom 0.406: R9.1 55.24,31.11 Q9.D 57.15,30.48 Q41.G Q25.G
D9_N
  Bottom 0.406: R10.1 48.9,31.11 Q10.D 50.8,30.48 Q42.G Q26.G
D10_N
  Bottom 0.406: R11.1 42.55,31.11 Q11.D 44.45,30.48 Q43.G Q27.G
D11_N
  Bottom 0.406: R12.1 36.2,31.11 Q12.D 38.1,30.48 Q44.G Q28.G
D12_N
  Bottom 0.406: R13.1 29.84,31.11 Q13.D 31.75,30.48 Q45.G Q29.G
D13_N
  Bottom 0.406: R14.1 23.5,31.11 Q14.D 25.4,30.48 Q46.G Q30.G
D14_N
  Bottom 0.406: R15.1 17.14,31.11 Q15.D 19.05,30.48 Q47.G Q31.G
D15_N
  Bottom 0.406: Q32.G Q48.G 12.7,30.48 Q16.D 10.79,31.11 R16.1
GND
  Top 0.406: 42.55,1.91 43.18,1.27 73.03,1.27 73.66,1.91
  Top 0.61: Q16.S Q15.S Q14.S Q13.S Q12.S Q11.S Q10.S Q9.S Q8.S Q7.S Q6.S Q5.S Q4.S Q3.S Q2.S Q1.S | Q48.S Q47.S Q46.S Q45.S Q44.S Q43.S Q42.S Q41.S Q40.S Q39.S Q38.S Q37.S Q36.S Q35.S Q34.S Q33.S | Q17.S 106.05,20.95 103.5,20.95 102.87,21.59 Q18.S 99.69,20.95 97.16,20.95 96.52,21.59 Q19.S 93.34,20.95 90.81,20.95 90.17,21.59 Q20.S 87,20.95 84.45,20.95 83.82,21.59 Q21.S 80.64,20.95 78.11,20.95 77.47,21.59 Q22.S 74.3,20.95 71.75,20.95 71.12,21.59 Q23.S 67.94,20.95 65.41,20.95 64.77,21.59 Q24.S 61.59,20.95 59.05,20.95 58.42,21.59 Q25.S 55.24,20.95 52.07,20.95 51.44,21.59 Q26.S 48.9,20.95 45.72,20.95 45.09,21.59 Q27.S 42.55,20.95 40.01,20.95 39.37,21.59 Q28.S 36.2,20.95 33.66,20.95 33.02,21.59 Q29.S 29.84,20.95 26.67,20.95 26.04,21.59 Q30.S 23.5,20.95 20.32,20.95 19.68,21.59 Q31.S 17.14,20.95 14.61,20.95 13.97,21.59 Q32.S 10.79,21.59 6.99,17.78 6.99,14.61 J2.20 17.78,1.91 30.48,1.91 | J2.11 J2.10 30.48,1.91 | J3.11 J3.10 86.36,1.91 | 57.15,53.98 45.09,53.98 45.09,49.53 | 57.15,53.98 69.85,53.98 J1.20 | C1.2 15.24,48.9 19.05,52.7 PP1.1 24.77,48.26 43.81,48.26 45.09,49.53 | J1.1 45.09,49.53 | 57.15,53.98 J1.10 J1.11 | J3.20 73.66,1.91 86.36,1.91 | 86.36,1.91 98.42,1.91 99.06,2.54 99.06,3.81 J3.1 | 30.48,1.91 42.55,1.91 42.55,5.08 41.27,6.35 J2.1
  Bottom 0.61: C1.2 17.78,41.91 Q15.S | Q48.S 8.26,27.94 6.99,29.21 6.99,33.02 8.26,34.29 Q16.S | Q31.S 17.78,23.5 16.51,24.77 16.51,26.67 Q47.S
IN0  (via drill 0.5 pad 1.02)
  Top 0.406: J1.2 48.26,50.8 v48.26,42.55
  Bottom 0.406: v48.26,42.55 48.9,43.18 107.31,43.18 107.95,42.55 Q1.G
IN1  (via drill 0.5 pad 1.02)
  Top 0.406: J1.3 v49.53,41.91
  Bottom 0.406: v49.53,41.91 50.16,42.55 100.97,42.55 101.6,41.91 Q2.G
IN2  (via drill 0.5 pad 1.02)
  Top 0.406: J1.4 50.8,50.8 v50.8,41.27
  Bottom 0.406: v50.8,41.27 51.44,41.91 94.61,41.91 95.25,41.27 Q3.G
IN3  (via drill 0.5 pad 1.02)
  Top 0.406: J1.5 v52.07,40.64
  Bottom 0.406: v52.07,40.64 52.7,41.27 88.27,41.27 88.9,40.64 Q4.G
IN4  (via drill 0.5 pad 1.02)
  Top 0.406: J1.6 53.34,50.8 v53.34,40.01
  Bottom 0.406: v53.34,40.01 53.98,40.64 81.92,40.64 82.55,40.01 Q5.G
IN5  (via drill 0.5 pad 1.02)
  Top 0.406: J1.7 v54.61,39.37
  Bottom 0.406: v54.61,39.37 55.24,40.01 75.56,40.01 76.2,39.37 Q6.G
IN6  (via drill 0.5 pad 1.02)
  Top 0.406: J1.8 55.88,50.8 v55.88,38.73
  Bottom 0.406: v55.88,38.73 56.52,39.37 69.22,39.37 69.85,38.73 Q7.G
IN7  (via drill 0.5 pad 1.02)
  Top 0.406: J1.9 v57.15,38.1
  Bottom 0.406: v57.15,38.1 57.78,38.73 62.87,38.73 63.5,38.1 Q8.G
IN8  (via drill 0.5 pad 1.02)
  Top 0.406: J1.12 60.96,50.8 v60.96,36.83
  Bottom 0.406: v60.96,36.83 60.96,35.56 58.42,33.02 Q9.G
IN9  (via drill 0.5 pad 1.02)
  Top 0.406: J1.13 v62.23,37.47
  Bottom 0.406: v62.23,37.47 61.59,38.1 59.05,38.1 57.78,36.83 56.52,36.83 54.61,34.92 52.7,34.92 Q10.G
IN10  (via drill 0.5 pad 1.02)
  Top 0.406: J1.14 63.5,50.8 v63.5,44.45
  Bottom 0.406: v63.5,44.45 62.87,45.09 45.09,45.09 44.45,44.45 Q11.G
IN11  (via drill 0.5 pad 1.02)
  Top 0.406: J1.15 v64.77,45.09
  Bottom 0.406: v64.77,45.09 64.14,45.72 38.73,45.72 38.1,45.09 Q12.G
IN12  (via drill 0.5 pad 1.02)
  Top 0.406: J1.16 66.04,50.8 v66.04,45.72
  Bottom 0.406: v66.04,45.72 65.41,46.35 32.38,46.35 31.75,45.72 Q13.G
IN13  (via drill 0.5 pad 1.02)
  Top 0.406: J1.17 v67.31,46.35
  Bottom 0.406: v67.31,46.35 66.67,46.99 26.04,46.99 25.4,46.35 Q14.G
IN14  (via drill 0.5 pad 1.02)
  Top 0.406: J1.18 68.58,50.8 v68.58,46.99
  Bottom 0.406: v68.58,46.99 67.94,47.62 19.68,47.62 19.05,46.99 Q15.G
IN15
  Bottom 0.406: J1.19 69.85,48.9 69.22,48.26 13.34,48.26 12.7,47.62 Q16.G

### Text on the board
tPlace: 5V | 0V | BUF_BUS_TEE_1 | James Newman